# Altium project BMS Interface Board.PrjPcb
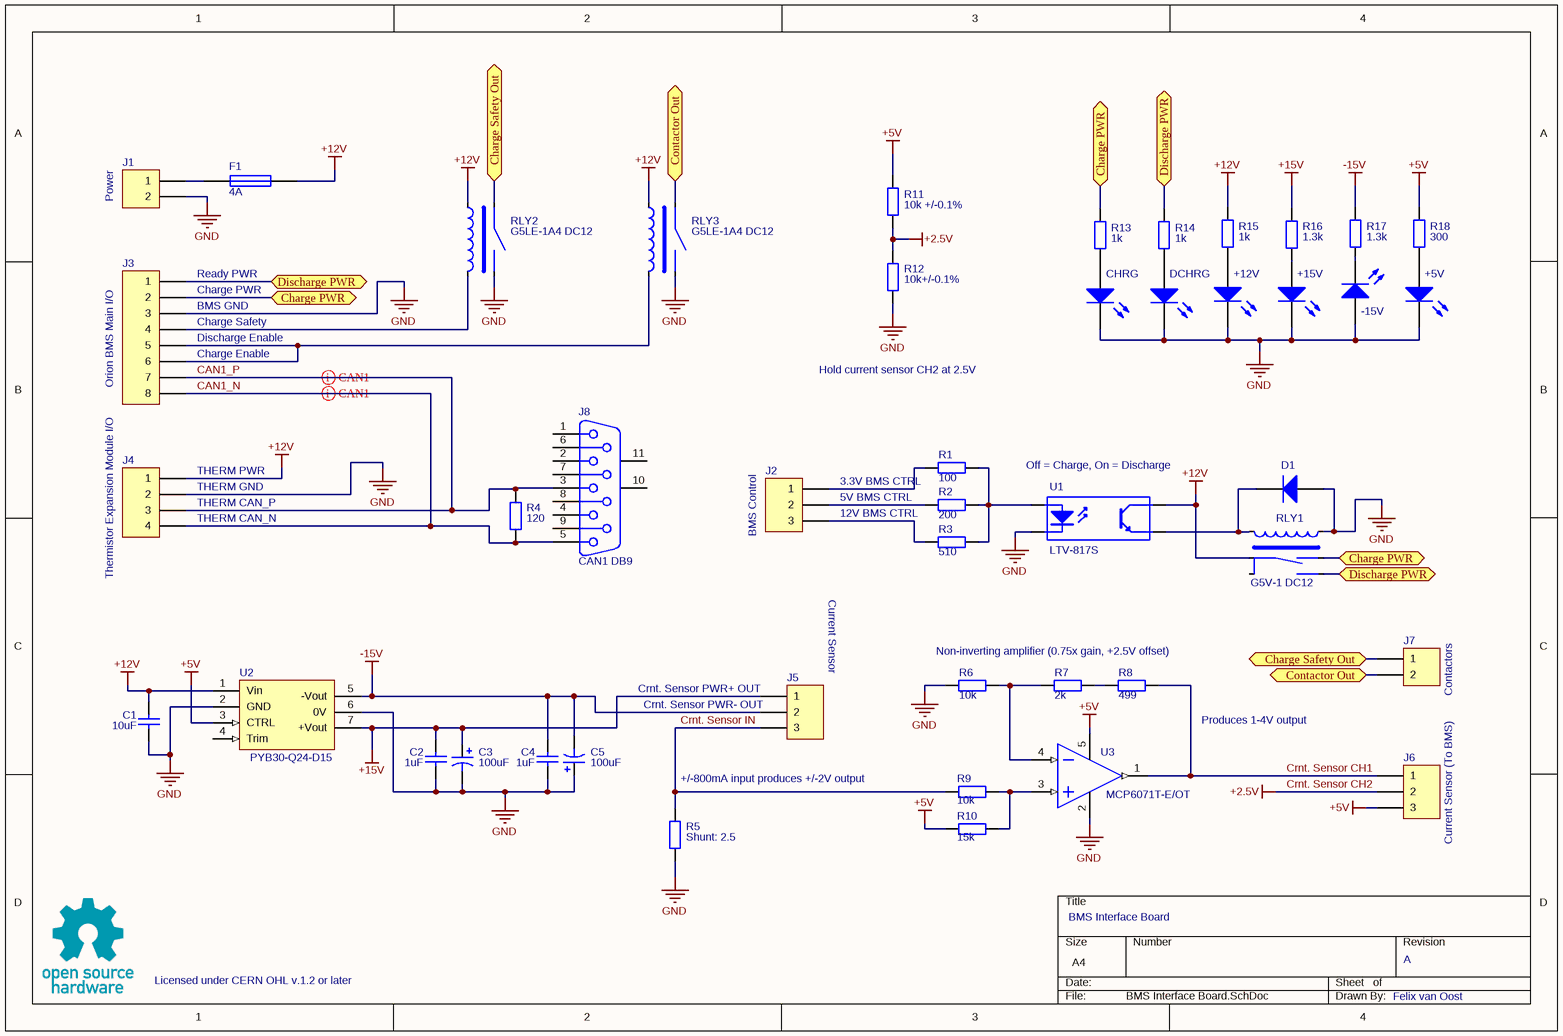
[diagram p0: BMS Interface Board.SchDoc]
1 sheet, 45 parts. Net scope: flat (ports and power ports of the same name join across sheets).
Board file: BMS Interface Board.PcbDoc

## Sheet BMS Interface Board.SchDoc: BMS Interface Board
size A4; DrawnBy: Felix van Oost; Engineer: Felix van Oost; Organization: UBC Electric Car Club; DocumentNumber: 1; Revision: A; SheetNumber: 1; SheetTotal: 1; ProjectName: BMS Interface Board

### Parts
+5V  LTST-C170GKT  [Lite-On LTST-C170GKT (2012)]  (value not drawn)
+12V  LTST-C170GKT  [Lite-On LTST-C170GKT (2012)]  (value not drawn)
+15V  LTST-C170GKT  [Lite-On LTST-C170GKT (2012)]  (value not drawn)
-15V  LTST-C170GKT  [Lite-On LTST-C170GKT (2012)]  (value not drawn)
C1  value 10uF  [Kemet Ceramic Capacitor (2012)]  (hidden comment: Cap)
C2  value 1uF  [Kemet Ceramic Capacitor (2012)]  (hidden comment: Cap)
C3  value 100uF  [Panasonic EEE-1EA101XAP]  (hidden comment: Cap)
C4  value 1uF  [Kemet Ceramic Capacitor (2012)]  (hidden comment: Cap)
C5  value 100uF  [Panasonic EEE-1EA101XAP]  (hidden comment: Cap)
CHRG  LTST-C170GKT  [Lite-On LTST-C170GKT (2012)]  (value not drawn)
D1  S1G  [Fairchild S1G (DO-214AC)]  (value not drawn)
DCHRG  LTST-C170GKT  [Lite-On LTST-C170GKT (2012)]  (value not drawn)
F1  4A  [Littelfuse 01530007Z]
J1  Molex Mega-Fit 172064-0002  [Molex Mega-Fit 172064-0002]  (value not drawn)
J2  Molex Micro-Fit 43650-0300  [Molex Micro-Fit 43650-0300]  (value not drawn)
J3  Molex Micro-Fit 43045-0800  [Molex Micro-Fit 43045-0800]  (value not drawn)
J4  Molex Micro-Fit 43045-0400  [Molex Micro-Fit 43045-0400]  (value not drawn)
J5  Molex Micro-Fit 43650-0300  [Molex Micro-Fit 43650-0300]  (value not drawn)
J6  Molex Micro-Fit 43650-0300  [Molex Micro-Fit 43650-0300]  (value not drawn)
J7  Molex Mega-Fit 172064-0002  [Molex Mega-Fit 172064-0002]  (value not drawn)
J8  CAN1 DB9  [TE Connectivity 1734354-1]
R1  value 100  [Philips ERJ Series Resistor (2012)]
R2  value 200  [Philips ERJ Series Resistor (2012)]
R3  value 510  [Philips ERJ Series Resistor (2012)]
R4  value 120  [Philips ERJ Series Resistor (2012)]
R5  Shunt: 2.5  [Bourns PWR163S-25-2R50F (TO-252-3)]
R6  value 10k  [Philips ERJ Series Resistor (2012)]
R7  value 2k  [Philips ERJ Series Resistor (2012)]
R8  value 499  [Philips ERJ Series Resistor (2012)]
R9  value 10k  [Philips ERJ Series Resistor (2012)]
R10  value 15k  [Philips ERJ Series Resistor (2012)]
R11  value 10k +/-0.1%  [Philips ERJ Series Resistor (2012)]
R12  value 10k+/-0.1%  [Philips ERJ Series Resistor (2012)]
R13  value 1k  [Philips ERJ Series Resistor (2012)]
R14  value 1k  [Philips ERJ Series Resistor (2012)]
R15  value 1k  [Philips ERJ Series Resistor (2012)]
R16  value 1.3k  [Philips ERJ Series Resistor (2012)]
R17  value 1.3k  [Philips ERJ Series Resistor (2012)]
R18  value 300  [Philips ERJ Series Resistor (2012)]
RLY1  G5V-1 DC12  [Omron G5V-1 DC12]
RLY2  G5LE-1A4 DC12  [Omron G5LE-1A4 DC12]
RLY3  G5LE-1A4 DC12  [Omron G5LE-1A4 DC12]
U1  LTV-817S  [Lite-On LTV-817S (4-SOP)]
U2  PYB30-Q24-D15  [CUI PYB30-Series]
U3  MCP6071T-E/OT  [Microchip MCP6071T-E/OT (SOT-23-5)]

### Ports
Charge PWR, Charge Safety Out, Contactor Out, Discharge PWR

### Nets
+5V: J6.3 R10.2 R11.2 R18.1 U2.3(CTRL) U3.5(VDD)
+12V: C1.2 F1.1 J4.1 R15.1 RLY1.3(Common) RLY2.2(Coil) RLY3.2(Coil) U1.4(C) U2.1(Vin)
+15V: C2.2 C3.1 J5.1 R16.1 U2.7(+Vout)
-15V: C4.2 C5.2 J5.2 R17.1 U2.5(-Vout)
Crnt. Sensor CH2: J6.2 R11.1 R12.2  [also labelled +2.5V]
GND: +5V.2(K) +12V.2(K) +15V.2(K) -15V.1(A) C1.1 C2.1 C3.2 C4.1 C5.1 CHRG.2(K) D1.1(A) DCHRG.2(K) J1.2 J3.3 J4.2 R5.1 R6.2 R12.1 RLY1.5(Coil) RLY2.3(NO) RLY3.3(NO) U1.2(K) U2.2(GND) U2.6(0V) U3.2(VSS)
CAN1_N: J3.8 J4.4 J8.5 R4.1
CAN1_P: J3.7 J4.3 J8.3 R4.2
Crnt. Sensor CH1: J6.1 R8.1 U3.1(Vout)
Crnt. Sensor IN: J5.3 R5.2 R9.2
Net+5V_1: +5V.1(A) R18.2
Net+12V_1: +12V.1(A) R15.2
Net+15V_1: +15V.1(A) R16.2
Net-15V_2: -15V.2(K) R17.2
NetCHRG_1: CHRG.1(A) R13.2
NetD1_2: D1.2(K) RLY1.2(Coil) U1.3(E)
NetDCHRG_1: DCHRG.1(A) R14.2
NetF1_2: F1.2 J1.1
NetJ2_1: J2.1 R1.1
NetJ2_2: J2.2 R2.1
NetJ2_3: J2.3 R3.1
NetJ3_1: J3.1 R14.1 RLY1.6(N/O) ; port Discharge PWR
NetJ3_2: J3.2 R13.1 RLY1.1(N/C) ; port Charge PWR
NetJ3_4: J3.4 RLY2.4(Coil)
NetJ3_5: J3.5 J3.6 RLY3.4(Coil)
NetJ7_1: J7.1 RLY2.1(COM) ; port Charge Safety Out
NetJ7_2: J7.2 RLY3.1(COM) ; port Contactor Out
NetR1_2: R1.2 R2.2 R3.2 U1.1(A)
NetR6_1: R6.1 R7.2 U3.4(Vin+)
NetR7_1: R7.1 R8.2
NetR9_1: R9.1 R10.1 U3.3(Vin-)

Not connected (* = marked no-connect by the designer): J8 1 2 4 6 7 8 9 10(MH1) 11(MH2); RLY1 4(Common); U2 4(Trim)

### Layout directives
differential pair: CAN1_N, CAN1_P

### Notes on the sheet
- (near J1) Power
- (near J3) Ready PWR
- (near J3) Charge PWR
- (near J3) BMS GND
- (near J3) Orion BMS Main I/O
- (near J3) Discharge Enable
- (near J3) Charge Enable
- (near J3) Charge Safety
- Hold current sensor CH2 at 2.5V
- (near J4) THERM CAN_P
- (near J4) THERM GND
- (near J4) THERM PWR
- 5V BMS CTRL
- 12V BMS CTRL
- 3.3V BMS CTRL
- (near U1) Off = Charge, On = Discharge
- Thermistor Expansion Module I/O
- (near J4) THERM CAN_N
- (near J2) BMS Control
- Non-inverting amplifier (0.75x gain, +2.5V offset)
- (near J5) Crnt. Sensor PWR+ OUT
- (near J5) Crnt. Sensor PWR- OUT
- (near J5) Current Sensor
- (near J7) Contactors
- +/-800mA input produces +/-2V output
- Produces 1-4V output
- Current Sensor (To BMS)
- Licensed under CERN OHL v.1.2 or later

### Library data of the parts
+5V +12V +15V -15V CHRG DCHRG = LED0: Typical INFRARED GaAs LED; Published: 8-Jun-2000; LatestRevisionDate: 08-Jul-2005; LatestRevisionNote: Mech Layer 1 removed.; PackageReference: LED-0; Publisher: Altium Limited; PackageDescription: LED; 2 Leads
C1 C2 C4 = Cap: Capacitor; Published: 8-Jun-2000; LatestRevisionDate: 17-Jul-2002; LatestRevisionNote: Re-released for DXP Platform.; PackageReference: RAD-0.3; Publisher: Altium Limited; PackageDescription: Radial Cap, Thru-Hole; 2 Leads; 0.3 in Pin Spacing
C3 C5 = Cap Pol1: Polarized Capacitor (Radial); Published: 8-Jun-2000; LatestRevisionDate: 17-Jul-2002; LatestRevisionNote: Re-released for DXP Platform.; PackageReference: RB7.6-15; Publisher: Altium Limited; PackageDescription: Polarized Capacitor (Radial); 2 Leads
D1 = Diode 1N4007: 1 Amp General Purpose Rectifier; Published: 8-Jun-2000; LatestRevisionDate: 17-Jul-2002; LatestRevisionNote: Re-released for DXP Platform.; DatasheetVersion: 1998; PackageVersion: Aug-1999; PackageReference: DO-41; Publisher: Altium Limited; PackageDescription: Diode, Axial; Body 5.2 x 2.7 mm (LxDia. max), Lead Dia. 0.86 mm (max); Code_JEDEC: DO-204-AL; ComponentLink1Description: Manufacturer Link; ComponentLink1URL: http://www.fairchildsemi.com/; ComponentLink2Description: Datasheet; ComponentLink2URL: http://www.fairchildsemi.com/ds/1N%2F1N4001.pdf
F1 = Fuse 1: Fuse; Published: 8-Jun-2000; LatestRevisionDate: 17-Jul-2002; LatestRevisionNote: Re-released for DXP Platform.; PackageReference: PIN-W2/E2.8; Publisher: Altium Limited; PackageDescription: Thru-Hole; 2 Leads
J1 J7 = Molex Mega-Fit 172064-0002: 2-Pin Right-Angle Locking Male Header; Digi-Key Part Number: WM10391-ND
J2 J5 J6 = Molex Micro-Fit 43650-0300: 3-Pin Right-Angle Locking Male Header; Digi-Key Part Number: WM1861-ND
J3 = Molex Micro-Fit 43045-0800: 8-Pin Right-Angle Locking Male Header; Digi-Key Part Number: WM1816-ND
J4 = Molex Micro-Fit 43045-0400: 4-Pin Right-Angle Locking Male Header; Digi-Key Part Number: WM1814-ND
J8 = D Connector 9: Receptacle Assembly, 9 Position, Right Angle; PackageDocument: O; Positions: 9; Published: 15-Jun-2001; LatestRevisionDate: 17-Jul-2002; LatestRevisionNote: Re-released for DXP Platform.; DatasheetDocument: 1-Sep-1999; PackageReference: 788750; Publisher: Altium Limited; Orientation: Right Angle; Gender: Receptacle
R1-R18 = Res2: Resistor; Published: 8-Jun-2000; LatestRevisionDate: 17-Jul-2002; LatestRevisionNote: Re-released for DXP Platform.; PackageReference: AXIAL-0.4; Publisher: Altium Limited; PackageDescription: Axial Device, Thru-Hole; 2 Leads; 0.4 in Pin Spacing
RLY1 = Omron G5V-1 DC12: 12VDC 1A SPDT Relay; Digi-Key Part Number: Z774-ND
RLY2 RLY3 = Omron G5LE-1A4 DC12: 12VDC 10A SPST-NO Relay; Digi-Key Part Number: Z2352-ND
U1 = Optoisolator1: 4-Pin Phototransistor Optocoupler; Published: 24-Mar-1999; LatestRevisionDate: 04-Mar-2005; LatestRevisionNote: Sch pins 3 & 4 Swapped.; DatasheetVersion: Nov-2003; PackageReference: DIP-4; Publisher: Altium Limited
U2 = CUI PYB30-Q24-D15: +/-15V 1A DC-DC Converter; Digi-Key Part Number: 102-2941-ND
U3 = Microchip MCP6071T-E/OT: Low Offset Op-Amp; Digi-Key Part Number: MCP6071T-E/OTCT-ND